# Altium schematic sheet Power-scheme.SchDoc: Power Scheme
size A4; Author: Lázár Sándor; SheetNumber: 2; SheetTotal: 6; URL: lzrsystems.com
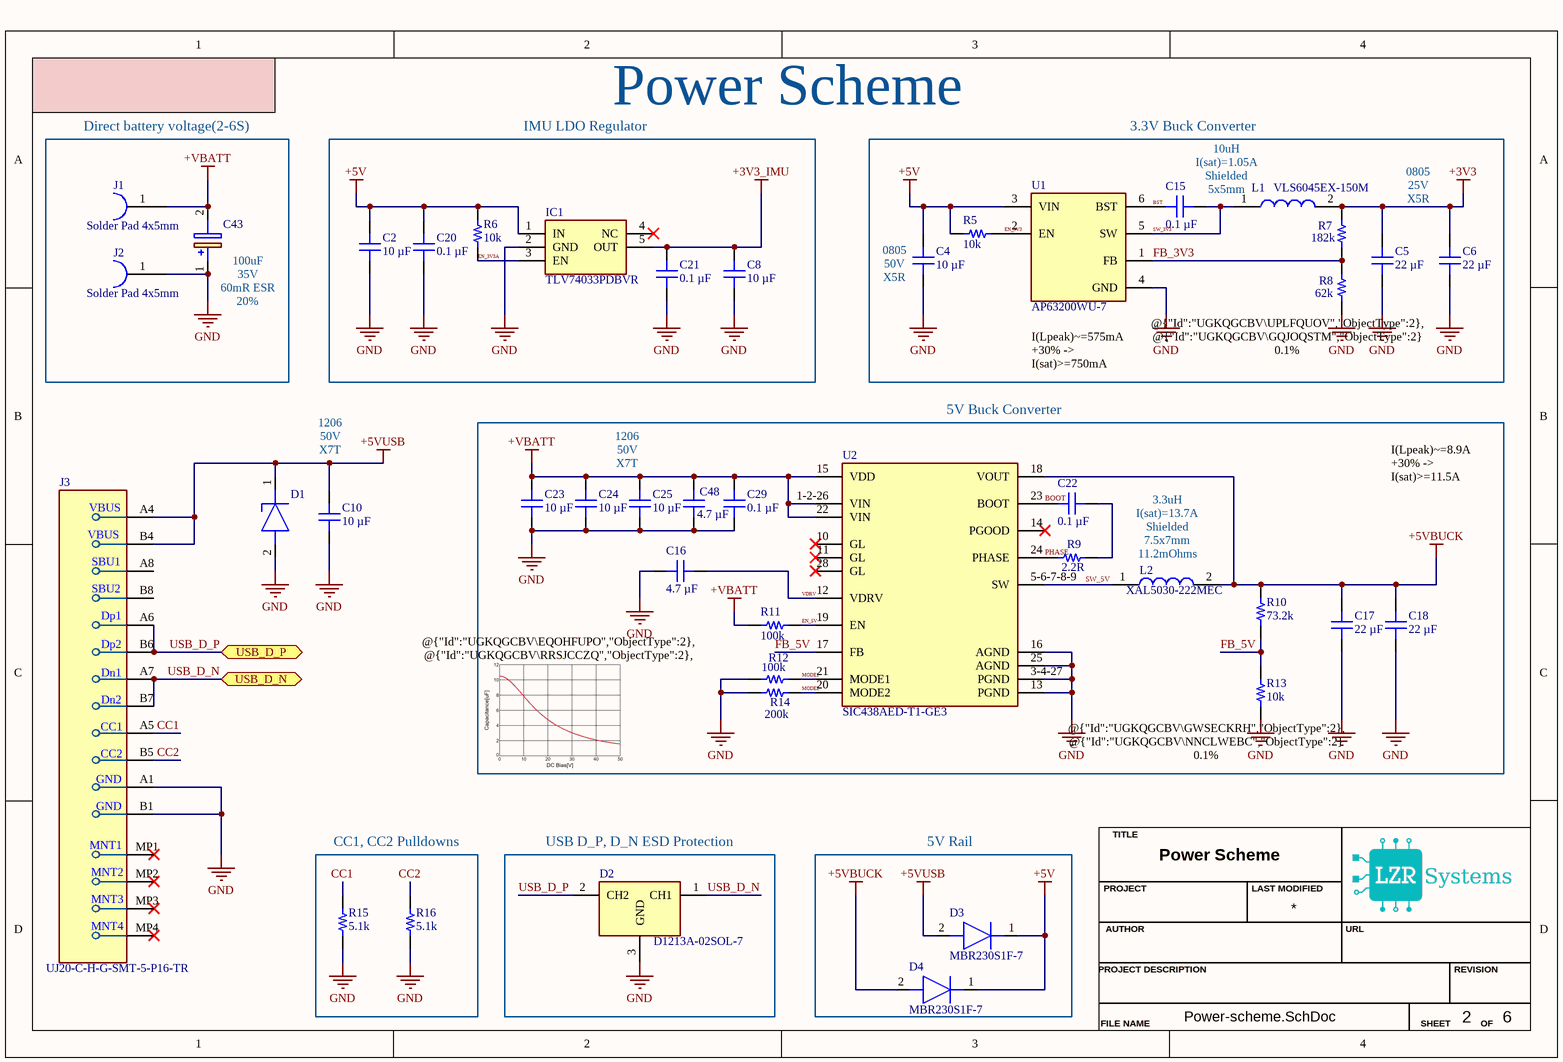
[diagram p0: Power-scheme.SchDoc]

## Parts
C2  10 µF  [MURATA GRM21B 0805_2012]
C4  10 µF  [MURATA GRM21B 0805_2012]
C5  22 µF  [MURATA GRM21B 0805_2012]
C6  22 µF  [MURATA GRM21B 0805_2012]
C8  10 µF  [MURATA GRM21B 0805_2012]
C10  10 µF  [MURATA GRM21B 0805_2012]
C15  0.1 µF  [MURATA GCM155 0402_1005]
C16  4.7 µF  [MURATA GRM21B 0805_2012]
C17  22 µF  [CAP 1206_3216 - 0.8MM]
C18  22 µF  [CAP 1206_3216 - 0.8MM]
C20  0.1 µF  [MURATA GCM155 0402_1005]
C21  0.1 µF  [MURATA GCM155 0402_1005]
C22  0.1 µF  [MURATA GCM155 0402_1005]
C23  10 µF  [CAP 1206_3216 - 0.8MM]
C24  10 µF  [CAP 1206_3216 - 0.8MM]
C25  10 µF  [CAP 1206_3216 - 0.8MM]
C29  0.1 µF  [MURATA GCM155 0402_1005]
C43  T523H107M035APE070  [CAPPM7360X200N]  (value not drawn)
C48  4.7 µF  [MURATA GRM21B 0805_2012]
D1  PESD24VS1UA  [SOD2512X110N]  (value not drawn)
D2  D1213A-02SOL-7  [D1213A02SOL7]
D3  MBR230S1F-7  [SODFL3518X115N]
D4  MBR230S1F-7  [SODFL3518X115N]
IC1  TLV74033PDBVR  [SOT95P280X145-5N]
J1  Solder Pad 4x5mm  [Solder Pad 4x5mm-Footprint-1]
J2  Solder Pad 4x5mm  [Solder Pad 4x5mm-Footprint-1]
J3  UJ20-C-H-G-SMT-5-P16-TR  [UJ20CHGSMT5P16TR]
L1  VLS6045EX-150M  [VLS6045]
L2  XAL5030-222MEC  [XAL5030222MEC]
R5  10k  [YAGEO RES 0402_1005]
R6  10k  [YAGEO RES 0402_1005]
R7  182k  [YAGEO RES 0402_1005]
R8  62k  [YAGEO RES 0402_1005]
R9  2.2R  [YAGEO RES 0402_1005]
R10  73.2k  [YAGEO RES 0402_1005]
R11  100k  [YAGEO RES 0402_1005]
R12  100k  [YAGEO RES 0402_1005]
R13  10k  [YAGEO RES 0402_1005]
R14  200k  [YAGEO RES 0402_1005]
R15  5.1k  [YAGEO RES 0402_1005]
R16  5.1k  [YAGEO RES 0402_1005]
U1  AP63200WU-7  [FP-TSOT26-MFG]
U2  SIC438AED-T1-GE3  [FP-T22-0442-MFG]

## Blocks framed on the sheet
Direct battery voltage(2-6S): C43 J1 J2
IMU LDO Regulator: C2 C8 C20 C21 IC1 R6
3.3V Buck Converter: C4-C6 C15 L1 R5 R7 R8 U1
5V Buck Converter: C16-C18 C22-C25 C29 C48 L2 R9-R14 U2
CC1, CC2 Pulldowns: R15 R16
USB D_P, D_N ESD Protection: D2
5V Rail: D3 D4

## Ports
USB_D_N (bidir), USB_D_P (bidir)

## Nets
+3V3: C5.2 C6.2 L1.2 R7.2
+3V3_IMU: C8.2 C21.2 IC1.5(OUT)
+5V: C2.2 C4.2 C20.2 D3.1(K) D4.1(K) IC1.1(IN) R5.2 R6.2 U1.3(VIN)
+5VBUCK: C17.2 C18.2 D4.2(A) L2.2 R10.2 U2.18(VOUT)
+5VUSB: C10.2 D1.1(K) D3.2(A) J3.A4(VBUS) J3.B4(VBUS_2)
+VBATT: C23.2 C24.2 C25.2 C29.2 C43.2(-) C48.2 J1.1 R11.1 U2.1-2-26(VIN) U2.15(VDD) U2.22(VIN)
GND: C2.1 C4.1 C5.1 C6.1 C8.1 C10.1 C16.1 C17.1 C18.1 C20.1 C21.1 C23.1 C24.1 C25.1 C29.1 C43.1(+) C48.1 D1.2(A) D2.3(GND) IC1.2(GND) J2.1 J3.A1(GND_1) J3.B1(GND_2) R8.2 R12.1 R13.2 R14.1 R15.1 R16.1 U1.4(GND) U2.3-4-27(PGND) U2.13(PGND) U2.16(AGND) U2.25(AGND)
BOOT: C22.2 U2.23(BOOT)
BST: C15.2 U1.6(BST)
CC1: J3.A5(CC1) R15.2
CC2: J3.B5(CC2) R16.2
EN_3V3: R5.1 U1.2(EN)
EN_3V3A: IC1.3(EN) R6.1
EN_5V: R11.2 U2.19(EN)
FB_3V3: R7.1 R8.1 U1.1(FB)
FB_5V: R10.1 R13.1 U2.17(FB)
MODE1: R12.2 U2.21(MODE1)
MODE2: R14.2 U2.20(MODE2)
PHASE: R9.1 U2.24(PHASE)
SW_3V3: C15.1 L1.1 U1.5(SW)
SW_5V: L2.1 U2.5-6-7-8-9(SW)
USB_D_N: D2.1(CH1) J3.A7(DN1) J3.B7(DN2) ; port USB_D_N
USB_D_P: D2.2(CH2) J3.A6(DP1) J3.B6(DP2) ; port USB_D_P
VDRV: C16.2 U2.12(VDRV)
NetC22_1: C22.1 R9.2

Not connected (* = marked no-connect by the designer): IC1 4(NC)*; J3 A8(SBU1) B8(SBU2) MP1* MP2* MP3* MP4*; U2 10(GL)* 11(GL)* 14(PGOOD)* 28(GL)*

## Notes on the sheet
- Power Scheme
- 10uH
  I(sat)=1.05A
  Shielded 5x5mm
- 0805
  25V
  X5R
- (near C43) 100uF
  35V
  60mR ESR
  20%
- (near C4) 0805
  50V
  X5R
- (near U1) I(Lpeak)~=575mA +30% ->
  I(sat)>=750mA
- (near R8) @{"Id":"UGKQGCBV\UPLFQUOV","ObjectType":2}, @{"Id":"UGKQGCBV\GQJOQSTM","ObjectType":2}
  0.1%
  25ppm
- 1206
  50V
  X7T
- I(Lpeak)~=8.9A +30% ->
  I(sat)>=11.5A
- (near L2) 3.3uH
  I(sat)=13.7A
  Shielded 7.5x7mm
  11.2mOhms
- @{"Id":"UGKQGCBV\EQOHFUPO","ObjectType":2}, @{"Id":"UGKQGCBV\RRSJCCZQ","ObjectType":2}, @{"Id":"UGKQGCBV\IXDVLWBT","ObjectType":2}
  DC Bias Characteristics
- (near R13) @{"Id":"UGKQGCBV\GWSECKRH","ObjectType":2}, @{"Id":"UGKQGCBV\NNCLWEBC","ObjectType":2}
  0.1%
  25ppm
- TITLE
- AUTHOR
- PROJECT
- LAST MODIFIED
- URL
- PROJECT DESCRIPTION
- REVISION
- FILE NAME
- SHEET
- OF
- (in symbol UJ20-C-H-G-SMT-5-P16-TR) Dp1; Dp2; Dn1; Dn2; GND; MNT1; MNT2; MNT3; MNT4

## Library data of the parts
C2 C4 C8 C10 = GRM21BR61H106ME43L: CAP CER 10UF 50V X5R 0805; manufacturer: Murata Electronics; Tolerance: ±20%; Part Number: GRM21BR61H106ME43L; Capacitance: 10 µF; Applications: General Purpose; componentlink1description: Datasheet; componentlink1url: https://search.murata.co.jp/Ceramy/image/img/A01X/G101/ENG/GRM21BR61H106ME43-01A.pdf; componentlink2description: DigiKey Link; componentlink2url: https://www.digikey.com/en/products/detail/murata-electronics/GRM21BR61H106ME43L/10326317; Device Package: 0805 (2012 Metric); lastupdated: 8/27/2024 9:29:56 AM; Lifecycle Status: Active; Minimum Order: 1; Mounting Type: Surface Mount, MLCC; Operating Temperature: -55°C ~ 85°C; Package / Case: 0805 (2012 Metric); packaging: TapeAndReel; partid: 41295; Part Status: Active; price: 0.05; series: GRM; Size / Dimension: 0.079" L x 0.049" W (2.00mm x 1.25mm); Supplier 1: DigiKey; Supplier Part Number 1: 490-18664-1-ND; Temperature Coefficient: X5R; Thickness (Max): 0.057" (1.45mm); value: 10 µF; Voltage - Rated: 50V
C5 C6 = GRM21BR61C226ME44L: CAP CER 22UF 16V X5R 0805; manufacturer: Murata Electronics; Tolerance: ±20%; Part Number: GRM21BR61C226ME44L; Capacitance: 22 µF; Applications: General Purpose; componentlink1description: Datasheet; componentlink1url: https://search.murata.co.jp/Ceramy/image/img/A01X/G101/ENG/GRM21BR61C226ME44-01.pdf; componentlink2description: DigiKey Link; componentlink2url: https://www.digikey.com/en/products/detail/murata-electronics/GRM21BR61C226ME44L/4905531; Device Package: 0805 (2012 Metric); lastupdated: 8/27/2024 9:29:55 AM; Lifecycle Status: Active; Minimum Order: 1; Mounting Type: Surface Mount, MLCC; Operating Temperature: -55°C ~ 85°C; Package / Case: 0805 (2012 Metric); packaging: TapeAndReel; partid: 16967; Part Status: Active; price: 0.06; series: GRM; Size / Dimension: 0.079" L x 0.049" W (2.00mm x 1.25mm); Supplier 1: DigiKey; Supplier Part Number 1: 490-10747-1-ND; Temperature Coefficient: X5R; Thickness (Max): 0.057" (1.45mm); value: 22 µF; Voltage - Rated: 16V
C15 C20-C22 C29 = GCM155R71H104ME02D: CAP CER 0.1UF 50V X7R 0402; manufacturer: Murata Electronics; Tolerance: ±20%; Part Number: GCM155R71H104ME02D; Capacitance: 0.1 µF; Applications: Automotive; componentlink1description: Datasheet; componentlink1url: https://psearch.en.murata.com/capacitor/product/GCM155R71H104ME02%23.pdf; componentlink2description: DigiKey Link; componentlink2url: https://www.digikey.com/en/products/detail/murata-electronics/GCM155R71H104ME02D/9867913; Device Package: 0402 (1005 Metric); lastupdated: 7/20/2024 2:04:19 AM; Lifecycle Status: Active; Minimum Order: 1; Mounting Type: Surface Mount, MLCC; Operating Temperature: -55°C ~ 125°C; Package / Case: 0402 (1005 Metric); packaging: TapeAndReel; partid: 39038; Part Status: Active; price: 0.01; Ratings: AEC-Q200; series: GCM; Size / Dimension: 0.039" L x 0.020" W (1.00mm x 0.50mm); Supplier 1: DigiKey; Supplier Part Number 1: 490-18204-1-ND; Temperature Coefficient: X7R; Thickness (Max): 0.022" (0.55mm); value: 0.1 µF; Voltage - Rated: 50V
C16 C48 = GRM21BR61H475KE51L: CAP CER 4.7UF 50V X5R 0805; manufacturer: Murata Electronics; Tolerance: ±10%; Part Number: GRM21BR61H475KE51L; Capacitance: 4.7 µF; Applications: General Purpose; componentlink1description: Datasheet; componentlink1url: https://search.murata.co.jp/Ceramy/image/img/A01X/G101/ENG/GRM21BR61H475KE51-01.pdf; componentlink2description: DigiKey Link; componentlink2url: https://www.digikey.com/en/products/detail/murata-electronics/GRM21BR61H475KE51L/4905540; Device Package: 0805 (2012 Metric); lastupdated: 8/27/2024 9:29:55 AM; Lifecycle Status: Active; Minimum Order: 1; Mounting Type: Surface Mount, MLCC; Operating Temperature: -55°C ~ 85°C; Package / Case: 0805 (2012 Metric); packaging: TapeAndReel; partid: 15077; Part Status: Active; price: 0.03; series: GRM; Size / Dimension: 0.079" L x 0.049" W (2.00mm x 1.25mm); Supplier 1: DigiKey; Supplier Part Number 1: 490-10751-1-ND; Temperature Coefficient: X5R; Thickness (Max): 0.055" (1.40mm); value: 4.7 µF; Voltage - Rated: 50V
C17 C18 = GRT31CC81C226ME01L: CAP CER 22UF 16V X6S 1206; manufacturer: Murata Electronics; Tolerance: ±20%; Part Number: GRT31CC81C226ME01L; Capacitance: 22 µF; Applications: Automotive; componentlink1description: Datasheet; componentlink1url: https://search.murata.co.jp/Ceramy/image/img/A01X/G101/ENG/GRT31CC81C226ME01-01.pdf; componentlink2description: DigiKey Link; componentlink2url: https://www.digikey.com/en/products/detail/murata-electronics/GRT31CC81C226ME01L/5416832; Device Package: 1206 (3216 Metric); lastupdated: 6/4/2024 7:10:39 PM; Lifecycle Status: Active; Minimum Order: 1; Mounting Type: Surface Mount, MLCC; Operating Temperature: -55°C ~ 105°C; Package / Case: 1206 (3216 Metric); packaging: TapeAndReel; partid: 20406; Part Status: Active; price: 0.09; Ratings: AEC-Q200; series: GRT; Size / Dimension: 0.126" L x 0.063" W (3.20mm x 1.60mm); Supplier 1: DigiKey; Supplier Part Number 1: 490-12410-1-ND; Temperature Coefficient: X6S; Thickness (Max): 0.071" (1.80mm); value: 22 µF; Voltage - Rated: 16V
C23-C25 = CGA5L3X5R1H106K160AB: CAP CER 10UF 50V X5R 1206; manufacturer: TDK Corporation; Tolerance: ±10%; Part Number: CGA5L3X5R1H106K160AB; Capacitance: 10 µF; Applications: Automotive; componentlink1description: Datasheet; componentlink1url: https://product.tdk.com/info/en/catalog/datasheets/mlcc_automotive_general_en.pdf?ref_disty=digikey; componentlink2description: DigiKey Link; componentlink2url: https://www.digikey.com/en/products/detail/tdk-corporation/CGA5L3X5R1H106K160AB/2781312; Device Package: 1206 (3216 Metric); lastupdated: 6/4/2024 7:10:33 PM; Lifecycle Status: Active; Minimum Order: 1; Mounting Type: Surface Mount, MLCC; Operating Temperature: -55°C ~ 85°C; Package / Case: 1206 (3216 Metric); packaging: TapeAndReel; partid: 54402; Part Status: Active; price: 0.22; Ratings: AEC-Q200; series: CGA; Size / Dimension: 0.126" L x 0.063" W (3.20mm x 1.60mm); Supplier 1: DigiKey; Supplier Part Number 1: 445-7886-1-ND; Temperature Coefficient: X5R; Thickness (Max): 0.075" (1.90mm); value: 10 µF; Voltage - Rated: 50V
C43 = T523H107M035APE070: Capacitor Polarised; Manufacturer_Name: KEMET; Datasheet Link: https://content.kemet.com/datasheets/KEM_T2079_SSD.pdf; Height: 2mm; Manufacturer_Part_Number: T523H107M035APE070; Mouser Part Number: 80-T523H107M35APE070; Mouser Price/Stock: https://www.mouser.co.uk/ProductDetail/KEMET/T523H107M035APE070?qs=unwgFEO1A6s1KPLWumNkZA%3D%3D; Arrow Part Number: T523H107M035APE070; Arrow Price/Stock: https://www.arrow.com/en/products/t523h107m035ape070/kemet-corporation
D1 = PESD24VS1UA,115: Diode ESD (Uni-directional); Manufacturer_Name: Nexperia; Datasheet Link: https://assets.nexperia.com/documents/data-sheet/PESD24VS1UA.pdf; Height: 1.1mm; Manufacturer_Part_Number: PESD24VS1UA,115; Mouser Part Number: 771-PESD24VS1UA115; Mouser Price/Stock: https://www.mouser.co.uk/ProductDetail/Nexperia/PESD24VS1UA115?qs=A1cBxND5mHKZ%252BhkKKiwSEA%3D%3D; Arrow Part Number: PESD24VS1UA,115; Arrow Price/Stock: https://www.arrow.com/en/products/pesd24vs1ua115/nexperia
D2 = D1213A-02SOL-7: TVS Diode (Uni-directional); Manufacturer_Name: Diodes Incorporated; Datasheet Link: https://www.diodes.com//assets/Datasheets/D1213A-02SOL.pdf; Height: 1.2mm; Manufacturer_Part_Number: D1213A-02SOL-7; Mouser Part Number: 621-D1213A-02SOL-7; Mouser Price/Stock: https://www.mouser.co.uk/ProductDetail/Diodes-Incorporated/D1213A-02SOL-7?qs=gfe7vQ8txpUT2qMa05IpnA%3D%3D; Arrow Part Number: D1213A-02SOL-7; Arrow Price/Stock: https://www.arrow.com/en/products/d1213a-02sol-7/diodes-incorporated?utm_currency=USD&region=nac
D3 D4 = MBR230S1F-7: Diode; Manufacturer_Name: Diodes Incorporated; Datasheet Link: https://www.diodes.com/assets/Datasheets/MBR230S1F.pdf; Height: 1.15mm; Manufacturer_Part_Number: MBR230S1F-7; Mouser Part Number: 621-MBR230S1F-7; Mouser Price/Stock: https://www.mouser.co.uk/ProductDetail/Diodes-Incorporated/MBR230S1F-7?qs=5V6w%252Be2aIqaf4rGxjeeHeQ%3D%3D; Arrow Part Number: MBR230S1F-7; Arrow Price/Stock: https://www.arrow.com/en/products/mbr230s1f-7/diodes-incorporated?region=nac
IC1 = TLV74033PDBVR: Integrated Circuit; Manufacturer_Name: Texas Instruments; Datasheet Link: https://www.ti.com/lit/ds/symlink/tlv740p.pdf?ts=1599647884466&ref_url=https%253A%252F%252Fwww.ti.com%252Fpower-management%252Flinear-regulators-ldo%252Fproducts.html; Height: 1.45mm; Manufacturer_Part_Number: TLV74033PDBVR; Mouser Part Number: 595-TLV74033PDBVR; Mouser Price/Stock: https://www.mouser.co.uk/ProductDetail/Texas-Instruments/TLV74033PDBVR?qs=sPbYRqrBIVkaG2WMvPh1eg%3D%3D; Arrow Part Number: TLV74033PDBVR; Arrow Price/Stock: https://www.arrow.com/en/products/tlv74033pdbvr/texas-instruments?utm_currency=USD&region=nac
J1 J2 = CMP-002-00080-1: Solerd Pad 4x5mm mainly for Flight Controller Vbatt
J3 = UJ20-C-H-G-SMT-5-P16-TR: Connector; Manufacturer_Name: Same Sky; Datasheet Link: https://www.sameskydevices.com/product/resource/UJ20-C-H-G-SMT-5-P16-TR.pdf; Height: 3.41mm; Manufacturer_Part_Number: UJ20-C-H-G-SMT-5-P16-TR; Mouser Part Number: 179-UJ20CHGSMT5P16TR; Mouser Price/Stock: https://www.mouser.co.uk/ProductDetail/Same-Sky/UJ20-C-H-G-SMT-5-P16-TR?qs=IKkN%2F947nfD2hE8asV9%252BEg%3D%3D; Arrow Part Number: UJ20-C-H-G-SMT-5-P16-TR; Arrow Price/Stock: https://www.arrow.com/en/products/uj20-c-h-g-smt-5-p16-tr/cui-devices?utm_currency=USD&region=nac
L1 = VLS6045EX-150M: Inductor; Manufacturer_Name: TDK; Datasheet Link: https://product.tdk.com/system/files/dam/doc/product/inductor/inductor/smd/catalog/inductor_commercial_power_vls6045ex_en.pdf; Manufacturer_Part_Number: VLS6045EX-150M; Mouser Part Number: 810-VLS6045EX-150M; Mouser Price/Stock: https://www.mouser.co.uk/ProductDetail/TDK/VLS6045EX-150M?qs=oF%2FSscNnLpDh4m%2FVdQ%2FgKQ%3D%3D; Arrow Part Number: VLS6045EX-150M; Arrow Price/Stock: https://www.arrow.com/en/products/vls6045ex-150m/tdk?region=nac
L2 = XAL5030-222MEC: Inductor; Manufacturer_Name: COILCRAFT; Datasheet Link: https://www.coilcraft.com/getmedia/49bc46c8-4b2c-45b9-9b6c-2eaa235ea698/xal50xx.pdf; Height: 3.1mm; Manufacturer_Part_Number: XAL5030-222MEC; Mouser Part Number: 994-XAL5030-222MEC; Mouser Price/Stock: https://www.mouser.co.uk/ProductDetail/Coilcraft/XAL5030-222MEC?qs=zCSbvcPd3pamMZlPWCpd5A%3D%3D
R5 R6 R13 = AC0402DR-0710KL: RES 10K OHM 0.5% 1/16W 0402; Manufacturer: Yageo; Power (Watts): 0.063W, 1/16W; Resistance: 10 kOhms; Temperature Coefficient: ±100ppm/°C; Part Number: AC0402DR-0710KL; Value: 10k; ComponentLink1Description: Datasheet; ComponentLink1URL: https://www.yageo.com/upload/media/product/productsearch/datasheet/rchip/PYu-AC_51_RoHS_L_9.pdf; ComponentLink2Description: DigiKey Link; ComponentLink2URL: https://www.digikey.com/en/products/detail/yageo/AC0402DR-0710KL/16990352; Composition: Thick Film; Device Package: 0402 (1005 Metric); Features: Automotive AEC-Q200, Moisture Resistant; Height - Seated (Max): 0.015" (0.37mm); LastUpdated: 8/31/2025 3:03:41 PM; Lifecycle Status: Active; Minimum Order: 1; Number of Terminations: 2; Operating Temperature: -55°C ~ 155°C; Package / Case: 0402 (1005 Metric); Packaging: TapeAndReel; PartId: 77661; Part Status: Active; Price: 0.01; Ratings: AEC-Q200; Series: AC; Size / Dimension: 0.039" L x 0.020" W (1.00mm x 0.50mm); Supplier 1: DigiKey; Supplier Part Number 1: 13-AC0402DR-0710KLCT-ND; Supplier Device Package: 0402; Tolerance: ±0.5%
R7 = AC0402FR-07182KL: RES SMD 182K OHM 1% 1/16W 0402; Manufacturer: Yageo; Power (Watts): 0.063W, 1/16W; Resistance: 182 kOhms; Temperature Coefficient: ±100ppm/°C; Part Number: AC0402FR-07182KL; Value: 182k; ComponentLink1Description: Datasheet; ComponentLink1URL: https://www.yageo.com/upload/media/product/productsearch/datasheet/rchip/PYu-AC_51_RoHS_L_10.pdf; ComponentLink2Description: DigiKey Link; ComponentLink2URL: https://www.digikey.com/en/products/detail/yageo/AC0402FR-07182KL/5895110; Composition: Thick Film; Device Package: 0402 (1005 Metric); Features: Automotive AEC-Q200, Moisture Resistant; Height - Seated (Max): 0.015" (0.37mm); LastUpdated: 8/31/2025 3:03:39 PM; Lifecycle Status: Active; Minimum Order: 1; Number of Terminations: 2; Operating Temperature: -55°C ~ 155°C; Package / Case: 0402 (1005 Metric); Packaging: CutTape; PartId: 79430; Price: 0.01; Ratings: AEC-Q200; Series: AC; Size / Dimension: 0.039" L x 0.020" W (1.00mm x 0.50mm); Supplier 1: DigiKey; Supplier Part Number 1: 13-AC0402FR-07182KLCT-ND; Supplier Device Package: 0402; Tolerance: ±1%
R8 = AC0402FR-0762KL: RES SMD 62K OHM 1% 1/16W 0402; Manufacturer: Yageo; Power (Watts): 0.063W, 1/16W; Resistance: 62 kOhms; Temperature Coefficient: ±100ppm/°C; Part Number: AC0402FR-0762KL; Value: 62k; ComponentLink1Description: Datasheet; ComponentLink1URL: https://www.yageo.com/upload/media/product/productsearch/datasheet/rchip/PYu-AC_51_RoHS_L_8.pdf; ComponentLink2Description: DigiKey Link; ComponentLink2URL: https://www.digikey.com/en/products/detail/yageo/AC0402FR-0762KL/5895460; Composition: Thick Film; Device Package: 0402 (1005 Metric); Features: Automotive AEC-Q200, Moisture Resistant; Height - Seated (Max): 0.015" (0.37mm); LastUpdated: 8/31/2025 3:03:55 PM; Lifecycle Status: Active; Minimum Order: 1; Number of Terminations: 2; Operating Temperature: -55°C ~ 155°C; Package / Case: 0402 (1005 Metric); Packaging: CutTape; PartId: 60448; Part Status: Active; Price: 0.01; Ratings: AEC-Q200; Series: AC; Size / Dimension: 0.039" L x 0.020" W (1.00mm x 0.50mm); Supplier 1: DigiKey; Supplier Part Number 1: 13-AC0402FR-0762KLCT-ND; Supplier Device Package: 0402; Tolerance: ±1%
R9 = AC0402FR-072R2L: RES SMD 2.2 OHM 1% 1/16W 0402; Manufacturer: Yageo; Power (Watts): 0.063W, 1/16W; Resistance: 2.2 Ohms; Temperature Coefficient: ±200ppm/°C; Part Number: AC0402FR-072R2L; Value: 2.2R; ComponentLink1Description: Datasheet; ComponentLink1URL: https://www.yageo.com/upload/media/product/productsearch/datasheet/rchip/PYu-AC_51_RoHS_L_7.pdf; ComponentLink2Description: DigiKey Link; ComponentLink2URL: https://www.digikey.com/en/products/detail/yageo/AC0402FR-072R2L/5895264; Composition: Thick Film; Device Package: 0402 (1005 Metric); Features: Automotive AEC-Q200, Moisture Resistant; Height - Seated (Max): 0.015" (0.37mm); LastUpdated: 8/31/2025 3:04:17 PM; Lifecycle Status: Active; Minimum Order: 1; Number of Terminations: 2; Operating Temperature: -55°C ~ 155°C; Package / Case: 0402 (1005 Metric); Packaging: CutTape; PartId: 3440; Part Status: Active; Price: 0.01; Ratings: AEC-Q200; Series: AC; Size / Dimension: 0.039" L x 0.020" W (1.00mm x 0.50mm); Supplier 1: DigiKey; Supplier Part Number 1: YAG3471CT-ND; Supplier Device Package: 0402; Tolerance: ±1%
R10 = AC0402FR-0773K2L: RES SMD 73.2K OHM 1% 1/16W 0402; Manufacturer: Yageo; Power (Watts): 0.063W, 1/16W; Resistance: 73.2 kOhms; Temperature Coefficient: ±100ppm/°C; Part Number: AC0402FR-0773K2L; Value: 73.2k; ComponentLink1Description: Datasheet; ComponentLink1URL: https://www.yageo.com/upload/media/product/productsearch/datasheet/rchip/PYu-AC_51_RoHS_L_7.pdf; ComponentLink2Description: DigiKey Link; ComponentLink2URL: https://www.digikey.com/en/products/detail/yageo/AC0402FR-0773K2L/5895501; Composition: Thick Film; Device Package: 0402 (1005 Metric); Features: Automotive AEC-Q200, Moisture Resistant; Height - Seated (Max): 0.015" (0.37mm); LastUpdated: 8/31/2025 3:04:14 PM; Lifecycle Status: Active; Minimum Order: 1; Number of Terminations: 2; Operating Temperature: -55°C ~ 155°C; Package / Case: 0402 (1005 Metric); Packaging: CutTape; PartId: 5215; Part Status: Active; Price: 0.01; Ratings: AEC-Q200; Series: AC; Size / Dimension: 0.039" L x 0.020" W (1.00mm x 0.50mm); Supplier 1: DigiKey; Supplier Part Number 1: YAG5685CT-ND; Supplier Device Package: 0402; Tolerance: ±1%
R11 R12 = AC0402JR-07100KL: RES SMD 100K OHM 5% 1/16W 0402; Manufacturer: Yageo; Power (Watts): 0.063W, 1/16W; Resistance: 100 kOhms; Temperature Coefficient: ±100ppm/°C; Part Number: AC0402JR-07100KL; Value: 100k; ComponentLink1Description: Datasheet; ComponentLink1URL: https://www.yageo.com/upload/media/product/productsearch/datasheet/rchip/PYu-AC_51_RoHS_L_7.pdf; ComponentLink2Description: DigiKey Link; ComponentLink2URL: https://www.digikey.com/en/products/detail/yageo/AC0402JR-07100KL/5895569; Composition: Thick Film; Device Package: 0402 (1005 Metric); Features: Automotive AEC-Q200, Moisture Resistant; Height - Seated (Max): 0.015" (0.37mm); LastUpdated: 8/31/2025 3:04:17 PM; Lifecycle Status: Active; Minimum Order: 1; Number of Terminations: 2; Operating Temperature: -55°C ~ 155°C; Package / Case: 0402 (1005 Metric); Packaging: CutTape; PartId: 3380; Part Status: Active; Price: 0.01; Ratings: AEC-Q200; Series: AC; Size / Dimension: 0.039" L x 0.020" W (1.00mm x 0.50mm); Supplier 1: DigiKey; Supplier Part Number 1: YAG3515CT-ND; Supplier Device Package: 0402; Tolerance: ±5%
R14 = AC0402JR-07200KL: RES SMD 200K OHM 5% 1/16W 0402; Manufacturer: Yageo; Power (Watts): 0.063W, 1/16W; Resistance: 200 kOhms; Temperature Coefficient: ±100ppm/°C; Part Number: AC0402JR-07200KL; Value: 200k; ComponentLink1Description: Datasheet; ComponentLink1URL: https://www.yageo.com/upload/media/product/productsearch/datasheet/rchip/PYu-AC_51_RoHS_L_8.pdf; ComponentLink2Description: DigiKey Link; ComponentLink2URL: https://www.digikey.com/en/products/detail/yageo/AC0402JR-07200KL/5895618; Composition: Thick Film; Device Package: 0402 (1005 Metric); Features: Automotive AEC-Q200, Moisture Resistant; Height - Seated (Max): 0.015" (0.37mm); LastUpdated: 8/31/2025 3:03:52 PM; Lifecycle Status: Active; Minimum Order: 1; Number of Terminations: 2; Operating Temperature: -55°C ~ 155°C; Package / Case: 0402 (1005 Metric); Packaging: CutTape; PartId: 65183; Part Status: Active; Price: 0.01; Ratings: AEC-Q200; Series: AC; Size / Dimension: 0.039" L x 0.020" W (1.00mm x 0.50mm); Supplier 1: DigiKey; Supplier Part Number 1: 13-AC0402JR-07200KLCT-ND; Supplier Device Package: 0402; Tolerance: ±5%
R15 R16 = AC0402JR-075K1L: RES SMD 5.1K OHM 5% 1/16W 0402; Manufacturer: Yageo; Power (Watts): 0.063W, 1/16W; Resistance: 5.1 kOhms; Temperature Coefficient: ±100ppm/°C; Part Number: AC0402JR-075K1L; Value: 5.1k; ComponentLink1Description: Datasheet; ComponentLink1URL: https://www.yageo.com/upload/media/product/productsearch/datasheet/rchip/PYu-AC_51_RoHS_L_7.pdf; ComponentLink2Description: DigiKey Link; ComponentLink2URL: https://www.digikey.com/en/products/detail/yageo/AC0402JR-075K1L/5895695; Composition: Thick Film; Device Package: 0402 (1005 Metric); Features: Automotive AEC-Q200, Moisture Resistant; Height - Seated (Max): 0.015" (0.37mm); LastUpdated: 8/31/2025 3:04:16 PM; Lifecycle Status: Active; Minimum Order: 1; Number of Terminations: 2; Operating Temperature: -55°C ~ 155°C; Package / Case: 0402 (1005 Metric); Packaging: CutTape; PartId: 4690; Part Status: Active; Price: 0.01; Ratings: AEC-Q200; Series: AC; Size / Dimension: 0.039" L x 0.020" W (1.00mm x 0.50mm); Supplier 1: DigiKey; Supplier Part Number 1: YAG3554CT-ND; Supplier Device Package: 0402; Tolerance: ±5%
U1 = CMP-019-00050-1: Switching Regulator
U2 = CMP-019-00059-1: Synchronous Buck Regulator Ultrasonic 28V I/P Adjustable O/P 8A 24-Pin PowerPAK MLP44 T/R; Min Supply Voltage: 3V; Output Voltage: 20V; Max Power Dissipation: 7.75W; Max Operating Temperature: 105°C; Max Supply Voltage: 28V; Min Operating Temperature: -40°C; Output Current: 8A